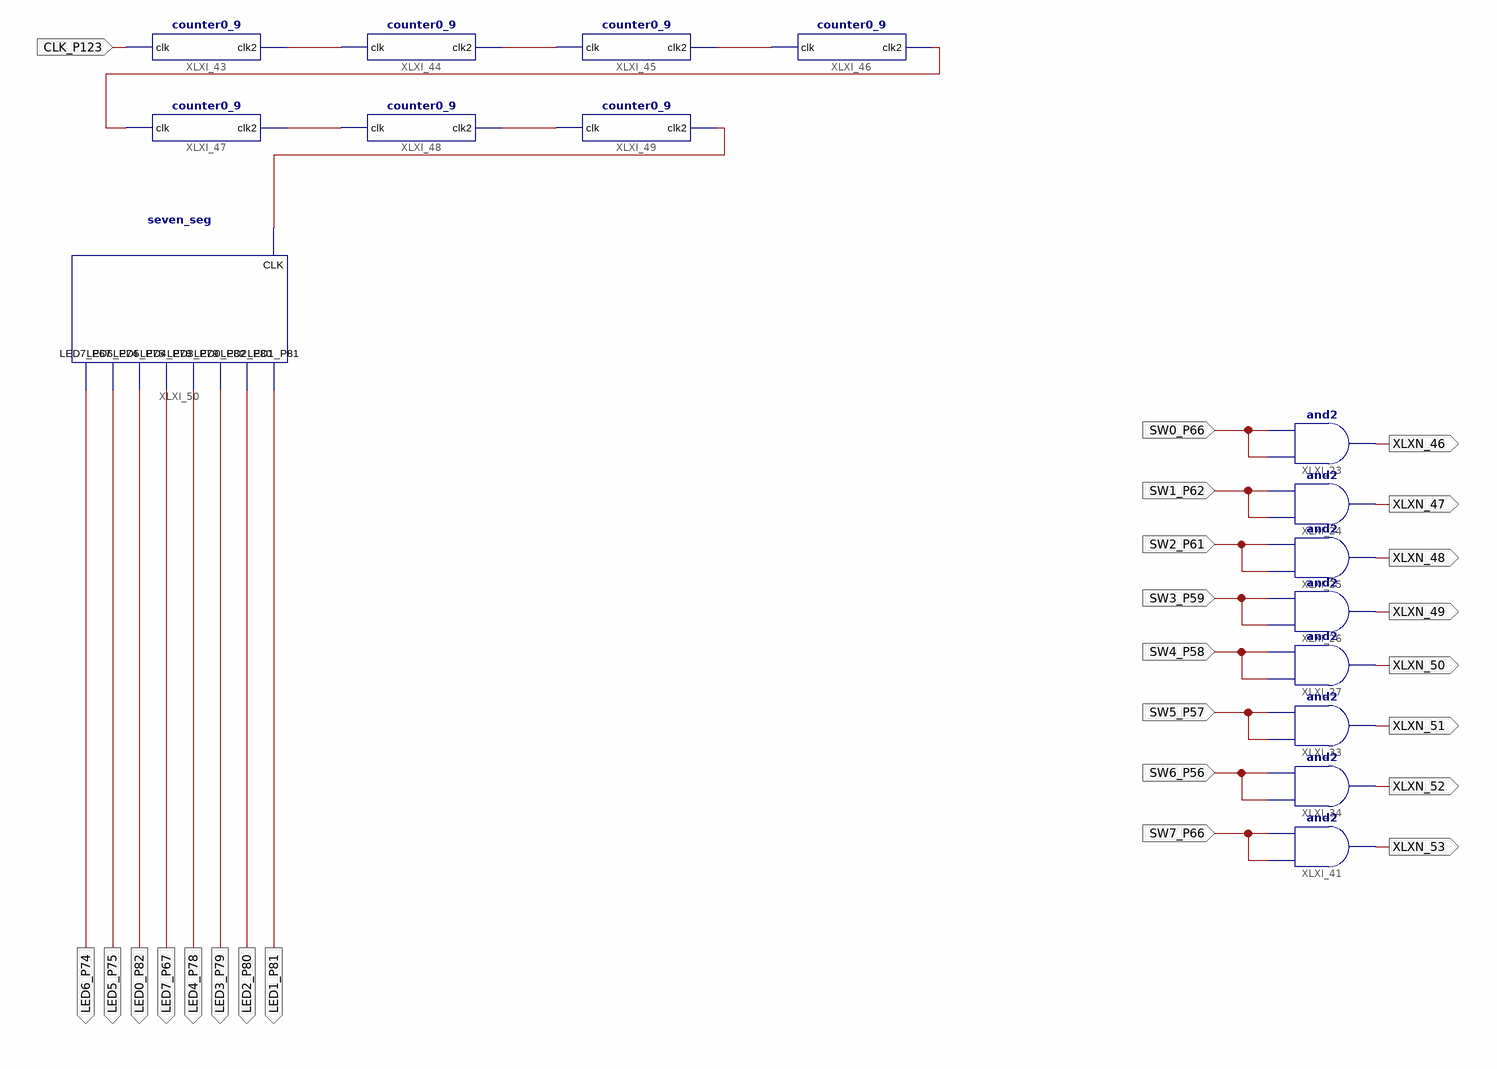
[diagram p0: schematic sheet 1]
// Xilinx ISE schematic sch_6.sch (spartan6) as structural Verilog: 16 symbols, 25 ports
module sch_6 (
  input  CLK_P123,
  input  SW0_P66,
  input  SW1_P62,
  input  SW2_P61,
  input  SW3_P59,
  input  SW4_P58,
  input  SW5_P57,
  input  SW6_P56,
  input  SW7_P66,
  output LED6_P74,
  output LED5_P75,
  output LED0_P82,
  output LED7_P67,
  output LED4_P78,
  output LED3_P79,
  output LED2_P80,
  output LED1_P81,
  output XLXN_46,
  output XLXN_47,
  output XLXN_48,
  output XLXN_49,
  output XLXN_50,
  output XLXN_51,
  output XLXN_52,
  output XLXN_53
);

  wire P82, XLXN_1, XLXN_2, XLXN_3, XLXN_4, XLXN_5, XLXN_6;

  counter0_9 XLXI_43 (.clk(CLK_P123), .clk2(XLXN_1));
  counter0_9 XLXI_44 (.clk(XLXN_1), .clk2(XLXN_2));
  counter0_9 XLXI_45 (.clk(XLXN_2), .clk2(XLXN_3));
  counter0_9 XLXI_46 (.clk(XLXN_3), .clk2(XLXN_4));
  counter0_9 XLXI_47 (.clk(XLXN_4), .clk2(XLXN_5));
  counter0_9 XLXI_48 (.clk(XLXN_5), .clk2(XLXN_6));
  counter0_9 XLXI_49 (.clk(XLXN_6), .clk2(P82));
  seven_seg XLXI_50 (
    .CLK(P82), .LED1_P81(LED1_P81), .LED2_P80(LED2_P80), .LED0_P82(LED3_P79), .LED3_P79(LED4_P78),
    .LED4_P78(LED7_P67), .LED5_P75(LED0_P82), .LED6_P74(LED5_P75), .LED7_P67(LED6_P74));
  and XLXI_23 (XLXN_46, SW0_P66, SW0_P66);
  and XLXI_24 (XLXN_47, SW1_P62, SW1_P62);
  and XLXI_25 (XLXN_48, SW2_P61, SW2_P61);
  and XLXI_26 (XLXN_49, SW3_P59, SW3_P59);
  and XLXI_27 (XLXN_50, SW4_P58, SW4_P58);
  and XLXI_33 (XLXN_51, SW5_P57, SW5_P57);
  and XLXI_34 (XLXN_52, SW6_P56, SW6_P56);
  and XLXI_41 (XLXN_53, SW7_P66, SW7_P66);
endmodule
